# Altium project GateWay-NRF-version.PrjPCB
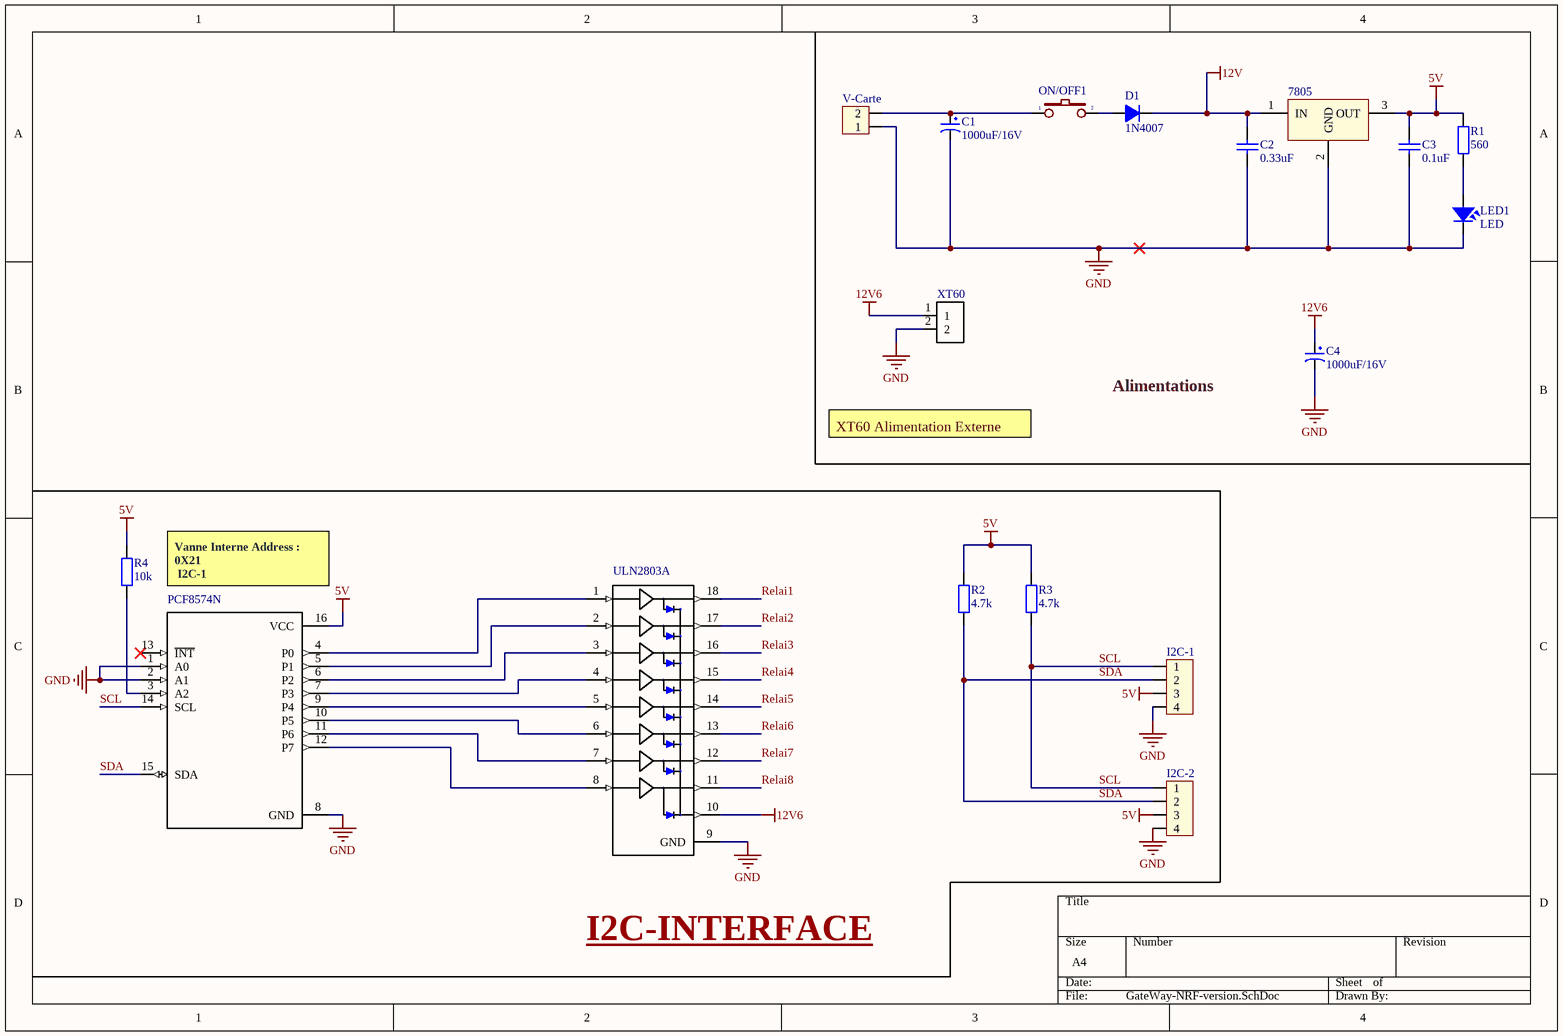
[diagram p0: GateWay-NRF-version.SchDoc]
3 sheets, 41 parts. Net scope: global (net labels, ports and power ports of the same name join across sheets).
Board file: GateWay-NRF-version.PcbDoc
Sheets:
  GateWay-NRF-version.SchDoc
  GateWay-NRF-version-puissance.SchDoc
  GateWay-NRF-version-commande.SchDoc

## Sheet GateWay-NRF-version.SchDoc
size A4

### Parts
7805  LM7805  [QTO-220]  (value not drawn)
C1  1000uF/16V  [CP1.5/3.4]
C2  value 0.33uF  [Cap Non-Pol 3mm]  (hidden comment: Cap Non-pol)
C3  value 0.1uF  [Cap Non-Pol 3mm]  (hidden comment: Cap Non-pol)
C4  1000uF/16V  [CP1.5/3.4]
D1  1N4007  [D1A]
I2C-1  I2C  [CON4]  (value not drawn)
I2C-2  I2C  [CON4]  (value not drawn)
LED1  LED  [LED-3]
ON/OFF1  ON/OFF  [SW2]  (value not drawn)
PCF8574N  PCF8574N  [*DIP794W45P254L1969H508Q16]  (value not drawn)
R1  560  [R1/4W]
R2  4.7k  [R1/4W]
R3  4.7k  [R1/4W]
R4  10k  [R1/4W]
ULN2803A  ULN2803A  [*DIP850W46P254L2324H393Q18]  (value not drawn)
V-Carte  Header 2  [HED2]  (value not drawn)
XT60  XT60_YELLOW  [*AMASS_XT60PB-M]  (value not drawn)

### Nets
5V: 7805.3(OUT) C3.2 I2C-1.3 I2C-2.3 PCF8574N.16(VCC) R1.1 R2.2 R3.2 R4.2
12V: 7805.1(IN) C2.2 D1.2(K)
12V6: C4.1 ULN2803A.10(COMMON) XT60.1
GND: 7805.2(GND) C1.2 C2.1 C3.1 C4.2 I2C-1.4 I2C-2.4 LED1.2 PCF8574N.1(A0) PCF8574N.2(A1) PCF8574N.8(GND) ULN2803A.9(GND) V-Carte.1 XT60.2
Relai1: ULN2803A.18(OUT_1)
Relai2: ULN2803A.17(OUT_2)
Relai3: ULN2803A.16(OUT_3)
Relai4: ULN2803A.15(OUT_4)
Relai5: ULN2803A.14(OUT_5)
Relai6: ULN2803A.13(OUT_6)
Relai7: ULN2803A.12(OUT_7)
Relai8: ULN2803A.11(OUT_8)
SCL: I2C-1.1 I2C-2.1 PCF8574N.14(SCL) R3.1
SDA: I2C-1.2 I2C-2.2 PCF8574N.15(SDA) R2.1
NetC1_1: C1.1 ON/OFF1.1 V-Carte.2
NetD1_1: D1.1(A) ON/OFF1.2
NetLED1_1: LED1.1 R1.2
NetPCF8574N_3: PCF8574N.3(A2) R4.1
NetPCF8574N_4: PCF8574N.4(P0) ULN2803A.1(IN_1)
NetPCF8574N_5: PCF8574N.5(P1) ULN2803A.2(IN_2)
NetPCF8574N_6: PCF8574N.6(P2) ULN2803A.3(IN_3)
NetPCF8574N_7: PCF8574N.7(P3) ULN2803A.4(IN_4)
NetPCF8574N_9: PCF8574N.9(P4) ULN2803A.5(IN_5)
NetPCF8574N_10: PCF8574N.10(P5) ULN2803A.6(IN_6)
NetPCF8574N_11: PCF8574N.11(P6) ULN2803A.7(IN_7)
NetPCF8574N_12: PCF8574N.12(P7) ULN2803A.8(IN_8)

Not connected (* = marked no-connect by the designer): PCF8574N 13(~{INT})*

### Notes on the sheet
- XT60 Alimentation Externe
- Alimentations
- Vanne Interne Address : 0X21
  I2C-1
- I2C-INTERFACE

### Library data of the parts
7805 = LM78xx_1: On ap +, from + 5 to + 24VDC; Value: LM7805
C1 C4 = CP4: Cap 1000uF/16V - 220uF/50V; Description 5: 4,7uF>10uF/250V_3,3uF>10uF/400V - 2,2uF>4,7uF/450V; Description 1: 2200uF-3300uF/6,3V - 1000uF-2200uF/10V; Description 2: 1000uF/16V - 470uF => 1000uF/25V - 100uF/100V; Description 3: 330uF>470uF/35V_220uF>470uF/50V_10uF>22uF/250V; Description 4: 220uF => 330uF/63V - 10uF =>33uF/160 - 200V; Value: 1000uF/16V
C2 C3 = Cap Non-pol: Non-polarized Capacitor; Published: 8-Jun-2000; LatestRevisionDate: 17-Jul-2002; LatestRevisionNote: Re-released for DXP Platform.; PackageReference: RAD-0.3; Publisher: Altium Limited
D1 = D1A: Diode 1A; Value: 1N4007
I2C-1 I2C-2 = Con4: Connector 4; Value: Connector 4
LED1 = LED: LED Single colour Green and Red; Value: LED 3 ly Single Colour
ON/OFF1 = SW2: Switch button 2 pin; Value: SW chip 2 pin
PCF8574N = PCF8574N: Remote 8-Bit I/O Expander for I2C-Bus 16-PDIP -40 to 85; MF: Texas Instruments; Price: None; SnapEDA_Link: https://www.snapeda.com/parts/PCF8574N/Texas%20Instruments/view-part/271889/?ref=snap; Mouser-Purchase-URL: https://snapeda.com/shop?store=Mouser&id=271889; BuyPart: https://www.snapeda.com/parts/PCF8574N/Texas%20Instruments/view-part/271889/?ref=eda; DigiKey-Purchase-URL: https://snapeda.com/shop?store=DigiKey&id=271889; Texas_Instruments-Purchase-URL: https://snapeda.com/shop?store=Texas+Instruments&id=271889; MP: PCF8574N; Package: PDIP-16 Texas Instruments; Availability: Good; Value: *
R1-R4 = R1/4W: Resistor 1/4W; Value: R1/4W - 1K
ULN2803A = ULN2803A: Bipolar (BJT) Transistor Array 8 NPN Darlington 50V 500mA 2.25W Through Hole 18-DIP; MF: STMicroelectronics; Package: DIP-18 STMicroelectronics; Digi-Key_Part_Number: 497-2356-5-ND; SnapEDA_Link: https://www.snapeda.com/parts/ULN2803A/STMicroelectronics/view-part/697285/?ref=snap; BuyPart: https://www.snapeda.com/parts/ULN2803A/STMicroelectronics/view-part/697285/?ref=eda; MP: ULN2803A; Value: *
V-Carte = Hed2: Header 2 (Green); Value: Header 2
XT60 = XT60: Power connector; 65A; PIN: 2; Colour: yellow-Male; MP: XT60 YELLOW; MF: Pololu; Availability: Unavailable; Package: None; Price: None; SnapEDA_Link: https://www.snapeda.com/parts/XT60%20YELLOW/Pololu/view-part/423230/?ref=snap; Value: *

## Sheet GateWay-NRF-version-puissance.SchDoc
size A4
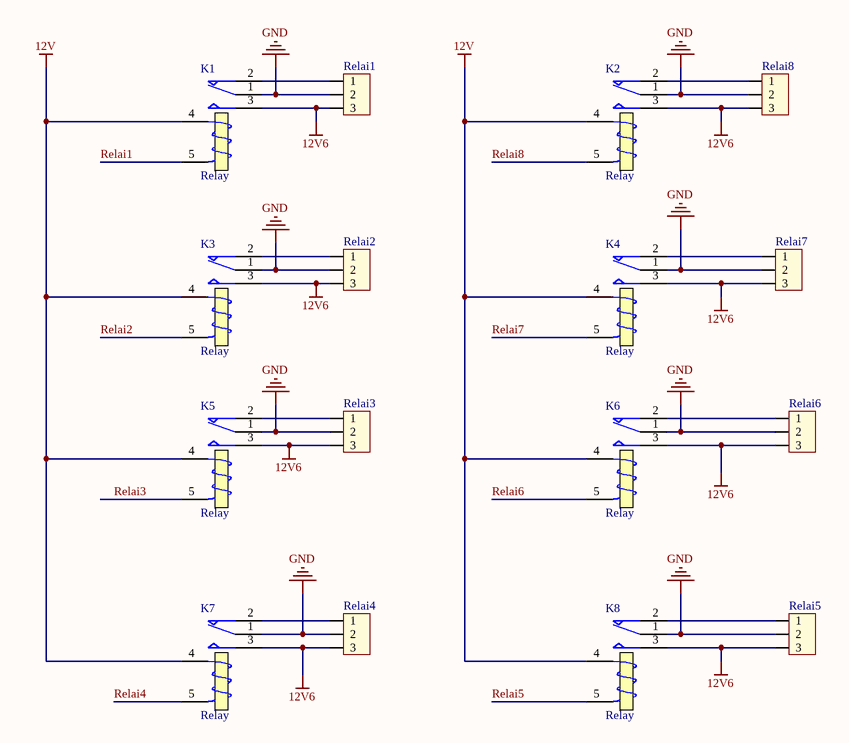
[diagram p1: GateWay-NRF-version-puissance.SchDoc]

### Parts
K1  Relay  [MODULE5B]
K2  Relay  [MODULE5B]
K3  Relay  [MODULE5B]
K4  Relay  [MODULE5B]
K5  Relay  [MODULE5B]
K6  Relay  [MODULE5B]
K7  Relay  [MODULE5B]
K8  Relay  [MODULE5B]
Relai1  Header 3  [HED3]  (value not drawn)
Relai2  Header 3  [HED3]  (value not drawn)
Relai3  Header 3  [HED3]  (value not drawn)
Relai4  Header 3  [HED3]  (value not drawn)
Relai5  Header 3  [HED3]  (value not drawn)
Relai6  Header 3  [HED3]  (value not drawn)
Relai7  Header 3  [HED3]  (value not drawn)
Relai8  Header 3  [HED3]  (value not drawn)

### Nets
12V: K1.4(T1) K2.4(T1) K3.4(T1) K4.4(T1) K5.4(T1) K6.4(T1) K7.4(T1) K8.4(T1)
12V6: K1.3(NO) K2.3(NO) K3.3(NO) K4.3(NO) K5.3(NO) K6.3(NO) K7.3(NO) K8.3(NO) Relai1.3 Relai2.3 Relai3.3 Relai4.3 Relai5.3 Relai6.3 Relai7.3 Relai8.3
GND: K1.1(COM) K2.1(COM) K3.1(COM) K4.1(COM) K5.1(COM) K6.1(COM) K7.1(COM) K8.1(COM) Relai1.2 Relai2.2 Relai3.2 Relai4.2 Relai5.2 Relai6.2 Relai7.2 Relai8.2
Relai1: K1.5(T2)
Relai2: K3.5(T2)
Relai3: K5.5(T2)
Relai4: K7.5(T2)
Relai5: K8.5(T2)
Relai6: K6.5(T2)
Relai7: K4.5(T2)
Relai8: K2.5(T2)
NetK1_2: K1.2(NC) Relai1.1
NetK2_2: K2.2(NC) Relai8.1
NetK3_2: K3.2(NC) Relai2.1
NetK4_2: K4.2(NC) Relai7.1
NetK5_2: K5.2(NC) Relai3.1
NetK6_2: K6.2(NC) Relai6.1
NetK7_2: K7.2(NC) Relai4.1
NetK8_2: K8.2(NC) Relai5.1

### Library data of the parts
K1-K8 = Relay: SPDT Relay; Published: 8-Jun-2000; LatestRevisionDate: 17-Jul-2002; LatestRevisionNote: Re-released for DXP Platform.; PackageReference: MODULE5B; Publisher: Altium Limited
Relai1-Relai8 = Hed3: Header 3 (Green); Value: Header 3

## Sheet GateWay-NRF-version-commande.SchDoc
size A4
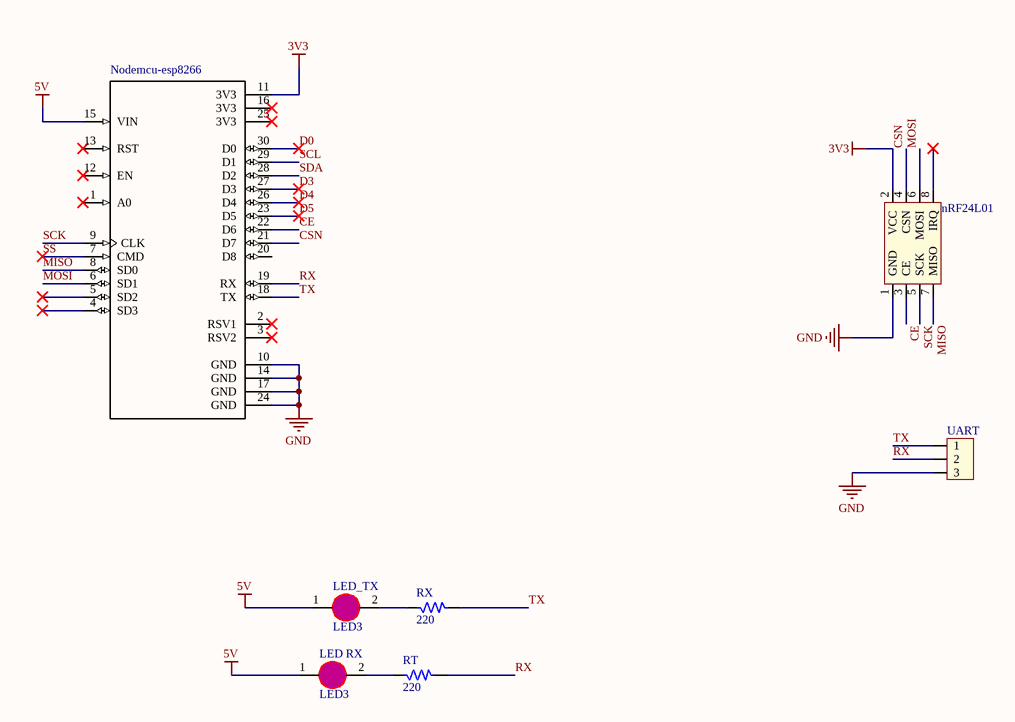
[diagram p2: GateWay-NRF-version-commande.SchDoc]

### Parts
LED_RX  LED3  [LED0805]
LED_TX  LED3  [LED0805]
Nodemcu-esp8266  ZC563900  [*MODULE_ZC563900]  (value not drawn)
nRF24L01  nRF24L01  [nRF24L01]  (value not drawn)
RT  220  [SM-1206]
RX  220  [SM-1206]
UART  UART  [CON3]  (value not drawn)

### Nets
3V3: Nodemcu-esp8266.11(3V3) nRF24L01.2(VCC)
5V: LED_RX.1(A) LED_TX.1(A) Nodemcu-esp8266.15(VIN)
GND: Nodemcu-esp8266.10(GND) Nodemcu-esp8266.14(GND) Nodemcu-esp8266.17(GND) Nodemcu-esp8266.24(GND) nRF24L01.1(GND) UART.3
CE: Nodemcu-esp8266.22(D6) nRF24L01.3(CE)
CSN: Nodemcu-esp8266.21(D7) nRF24L01.4(CSN)
D0: Nodemcu-esp8266.30(D0)
D3: Nodemcu-esp8266.27(D3)
D4: Nodemcu-esp8266.26(D4)
D5: Nodemcu-esp8266.23(D5)
MISO: Nodemcu-esp8266.8(SD0) nRF24L01.7(MISO)
MOSI: Nodemcu-esp8266.6(SD1) nRF24L01.6(MOSI)
RX: Nodemcu-esp8266.19(RX) RT.2 UART.2
SCK: Nodemcu-esp8266.9(CLK) nRF24L01.5(SCK)
SCL: Nodemcu-esp8266.29(D1)
SDA: Nodemcu-esp8266.28(D2)
SS: Nodemcu-esp8266.7(CMD)
TX: Nodemcu-esp8266.18(TX) RX.2 UART.1
NetLED_RX_2: LED_RX.2(K) RT.1
NetLED_TX_2: LED_TX.2(K) RX.1

Not connected (* = marked no-connect by the designer): Nodemcu-esp8266 1(A0)* 2(RSV1)* 3(RSV2)* 4(SD3)* 5(SD2)* 12(EN)* 13(RST)* 16(3V3)* 20(D8) 25(3V3)*; nRF24L01 8(IRQ)*

### Library data of the parts
LED_RX LED_TX = LEDSMD: LED 3mm
Nodemcu-esp8266 = ZC563900: NodeMcu Lua ESP8266 WIFI Internet of Things Network Development Module Board; MF: YKS; Package: None; Availability: Unavailable; MP: ZC563900; SnapEDA_Link: https://www.snapeda.com/parts/ZC563900/YKS/view-part/607853/?ref=snap; Price: None; Value: *
RT RX = R: Resistor 1/4W; Value: R1/4W - 1K
UART = Con3: Connector 3; Value: Connector 3

## Nets that join several sheets
5V: GateWay-NRF-version (9 pins), GateWay-NRF-version-commande (LED_RX.1 LED_TX.1 Nodemcu-esp8266.15)
12V: GateWay-NRF-version (7805.1 C2.2 D1.2), GateWay-NRF-version-puissance (8 pins)
12V6: GateWay-NRF-version (C4.1 ULN2803A.10 XT60.1), GateWay-NRF-version-puissance (16 pins)
GND: GateWay-NRF-version (14 pins), GateWay-NRF-version-puissance (16 pins), GateWay-NRF-version-commande (6 pins)
Relai1: GateWay-NRF-version (ULN2803A.18), GateWay-NRF-version-puissance (K1.5)
Relai2: GateWay-NRF-version (ULN2803A.17), GateWay-NRF-version-puissance (K3.5)
Relai3: GateWay-NRF-version (ULN2803A.16), GateWay-NRF-version-puissance (K5.5)
Relai4: GateWay-NRF-version (ULN2803A.15), GateWay-NRF-version-puissance (K7.5)
Relai5: GateWay-NRF-version (ULN2803A.14), GateWay-NRF-version-puissance (K8.5)
Relai6: GateWay-NRF-version (ULN2803A.13), GateWay-NRF-version-puissance (K6.5)
Relai7: GateWay-NRF-version (ULN2803A.12), GateWay-NRF-version-puissance (K4.5)
Relai8: GateWay-NRF-version (ULN2803A.11), GateWay-NRF-version-puissance (K2.5)
SCL: GateWay-NRF-version (I2C-1.1 I2C-2.1 PCF8574N.14 R3.1), GateWay-NRF-version-commande (Nodemcu-esp8266.29)
SDA: GateWay-NRF-version (I2C-1.2 I2C-2.2 PCF8574N.15 R2.1), GateWay-NRF-version-commande (Nodemcu-esp8266.28)